# Altium schematic sheet JTAG BUFFER.SchDoc
size A4; DocumentNumber: 6; SheetNumber: 7; SheetTotal: 14
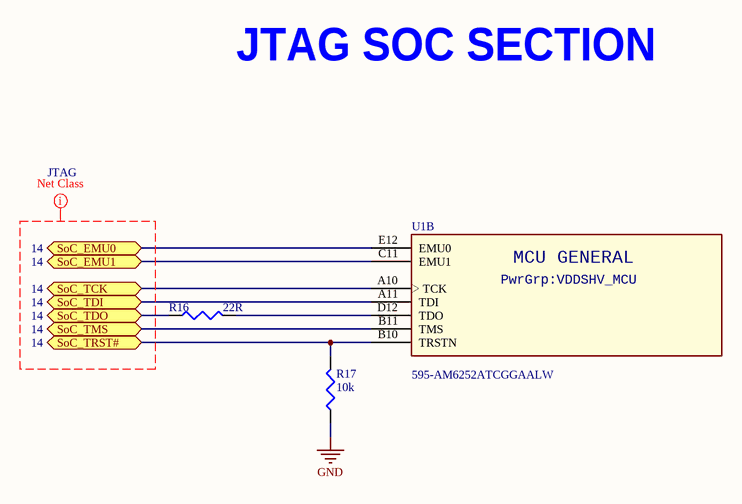
[diagram p0: JTAG BUFFER.SchDoc]

## Parts
R16  22R  [R0402]
R17  10k  [R0201]
U1  Supplier Part Number 1: 595-AM6252ATCGGAALW  [BGA425C50P25X25_1300X1300X89]  (hidden comment: AM62-EVM_BGA425)  (part B of 18)

## Ports
SoC_EMU0 (bidir, see 14), SoC_EMU1 (bidir, see 14), SoC_TCK (bidir, see 14), SoC_TDI (bidir, see 14), SoC_TDO (bidir, see 14), SoC_TMS (bidir, see 14), SoC_TRST# (bidir, see 14)

## Nets
GND: R17.1
SoC_EMU0: U1.E12(EMU0) ; port SoC_EMU0
SoC_EMU1: U1.C11(EMU1) ; port SoC_EMU1
SoC_TCK: U1.A10(TCK) ; port SoC_TCK
SoC_TDI: U1.A11(TDI) ; port SoC_TDI
SoC_TDO: R16.1 ; port SoC_TDO
SoC_TMS: U1.B11(TMS) ; port SoC_TMS
SoC_TRST#: R17.2 U1.B10(TRSTN) ; port SoC_TRST#
NetR16_2: R16.2 U1.D12(TDO)

## Layout directives
net class JTAG: (no net found under the mark)

## Notes on the sheet
- JTAG SOC SECTION
- (in symbol AM62-EVM_BGA425, part B) MCU GENERAL; PwrGrp:VDDSHV_MCU

## Library data of the parts
R16 = RC0402FR-0722RL: RES 22.0 OHM 1/16W 1% 0402 SMD; Manufacturer: Yageo; Resistance (Ohms): 22; Power (Watts): 0.063W, 1/16W; .Checked PCB: used; Temperature Coefficient: ±100ppm/°C; Category: Resistors; Supplier Part Number: 311-22.0LRCT-ND; Manufacturer Part Number: RC0402FR-0722RL; Package / Case: 0402 (1005 Metric); Price 1k [$]: 0.01421; Tolerance: ±1%; Value: 22R; .Checked SCH: used; Supplier: Digikey; Supplier 1: Digi-Key; Supplier Part Number 1: 311-22.0LRCT-ND; RoHS: RoHS Compliant; Stock 1: 943800; Pricing 1: 10=0.014, 50=0.0104, 100=0.0079, 250=0.00584, 500=0.00432, 1000=0.00288 (USD); Composition: Thick Film; Features: -; Size / Dimension: 0.039" L x 0.020" W (1.00mm x 0.50mm); Height: 0.016" (0.40mm); Number of Terminations: 2; Packaging: Cut Tape (CT); ComponentLink1URL: http://www.yageo.com/documents/recent/PYu-RC0402_51_RoHS_L_6.pdf; ComponentLink1Description: http://www.yageo.com/documents/recent/PYu-RC0402_51_RoHS_L_6.pdf
R17 = RC0201FR-0710KL: RES 10K OHM 1/20W 1% 0201 SMD; Manufacturer: Yageo; Power (Watts): 0.05W, 1/20W; Temperature Coefficient: ±200ppm/°C; .Creator: MM; Supplier 1: Digi-Key; Manufacturer Part Number: RC0201FR-0710KL; RoHS: RoHS Compliant; Category: Resistors; Stock 1: 529049; Pricing 1: 1=0.1, 10=0.074, 25=0.054, 100=0.0303, 250=0.02312, 500=0.0185, 1000=0.01361, 2500=0.01182, 5000=0.00976 (USD); Packaging: Cut Tape (CT); Resistance (Ohms): 10k; Tolerance: ±1%; Composition: Thick Film; Features: Moisture Resistant; Package / Case: 0201 (0603 Metric); Supplier Device Package: 0201; Size / Dimension: 0.024" L x 0.012" W (0.60mm x 0.30mm); Height: 0.010" (0.26mm); Number of Terminations: 2; ComponentLink1URL: http://www.yageo.com/documents/recent/PYu-RC0201_51_RoHS_L_8.pdf; ComponentLink1Description: http://www.yageo.com/documents/recent/PYu-RC0201_51_RoHS_L_8.pdf; Supplier Part Number 1: 311-10.0KMCT-ND; .Checked PCB: MM; .Checked SCH: MM
U1 = AM62-EVM_BGA425: ARM® Cortex®-A53 Microprocessor IC Sitara™ 2 Core, 64-Bit 1.4GHz 425-FCCSP (13x13); Manufacturer: Texas Instruments; Manufacturer Part Number: AM6252ATCGGAALW; Supplier 1: Mouser; Stock 1: 0; Pricing 1: 1=21.23, 10=19.58, 50=18.7, 100=18.7, 1000=15.94, 10000=15.94 (USD)